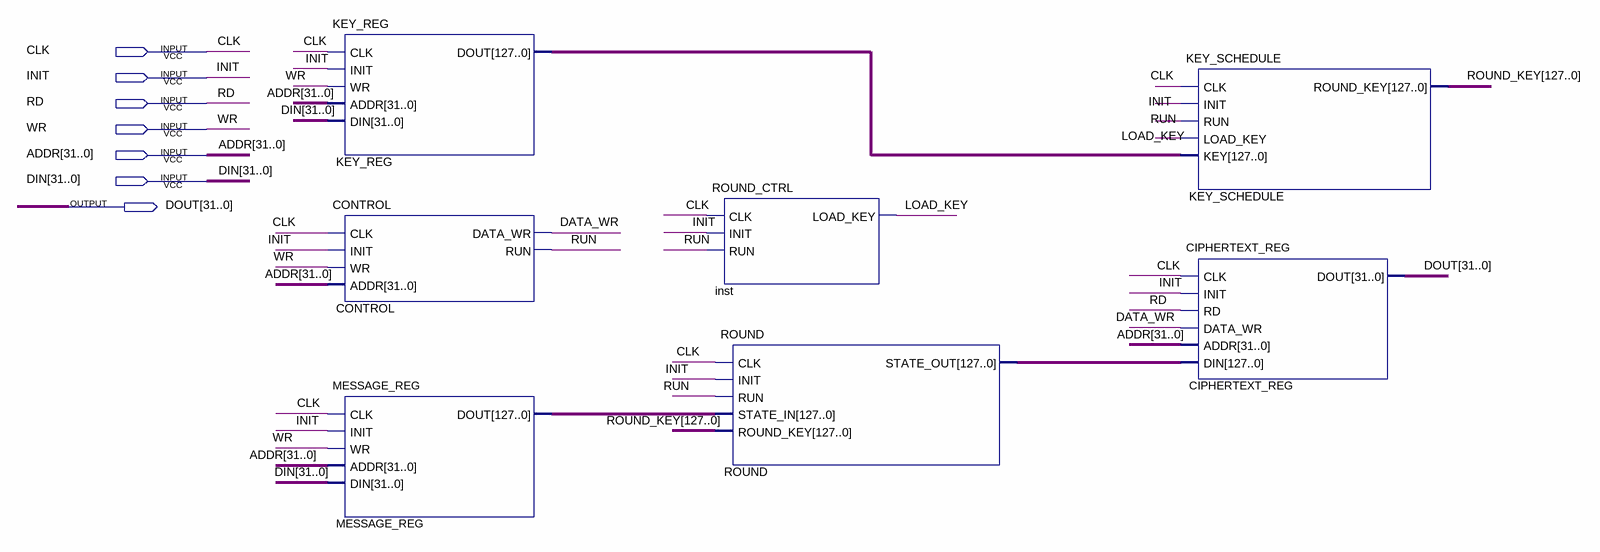
[diagram p0: schematic sheet]
// Quartus schematic AESGCM.bdf as structural Verilog: 7 symbols, 7 pins
module AESGCM (
  input  CLK,
  input  INIT,
  input  RD,
  input  WR,
  input  [31:0] ADDR,
  input  [31:0] DIN,
  output [31:0] DOUT
);

  wire DATA_WR, LOAD_KEY, RUN;
  wire [127:0] KEY_REG_dout, MESSAGE_REG_dout, ROUND_KEY, ROUND_state_out;

  KEY_REG KEY_REG (.CLK(CLK), .INIT(INIT), .WR(WR), .ADDR(ADDR), .DIN(DIN), .DOUT(KEY_REG_dout));
  CONTROL CONTROL (.CLK(CLK), .INIT(INIT), .WR(WR), .ADDR(ADDR), .DATA_WR(DATA_WR), .RUN(RUN));
  MESSAGE_REG MESSAGE_REG (.CLK(CLK), .INIT(INIT), .WR(WR), .ADDR(ADDR), .DIN(DIN), .DOUT(MESSAGE_REG_dout));
  ROUND_CTRL inst (.CLK(CLK), .INIT(INIT), .RUN(RUN), .LOAD_KEY(LOAD_KEY));
  ROUND ROUND (
    .CLK(CLK), .INIT(INIT), .RUN(RUN), .STATE_IN(MESSAGE_REG_dout), .ROUND_KEY(ROUND_KEY),
    .STATE_OUT(ROUND_state_out));
  KEY_SCHEDULE KEY_SCHEDULE (
    .CLK(CLK), .INIT(INIT), .RUN(RUN), .LOAD_KEY(LOAD_KEY), .KEY(KEY_REG_dout), .ROUND_KEY(ROUND_KEY));
  CIPHERTEXT_REG CIPHERTEXT_REG (
    .CLK(CLK), .INIT(INIT), .RD(RD), .DATA_WR(DATA_WR), .ADDR(ADDR), .DIN(ROUND_state_out), .DOUT(DOUT));
endmodule
